# Altium schematic sheet Motor Interface - Top Sheet.SchDoc: Title
size B; Organization: Midnight Sun Solar Rayce Car Team; Address1: University of Waterloo; Address2: 200 University Ave W; Address3: Waterloo, ON, Canada; Address4: N2L 3E9; DocumentNumber: 1; SheetNumber: 1; SheetTotal: 6; Website: www.uwmidsun.com; ProjectName: ProjectName
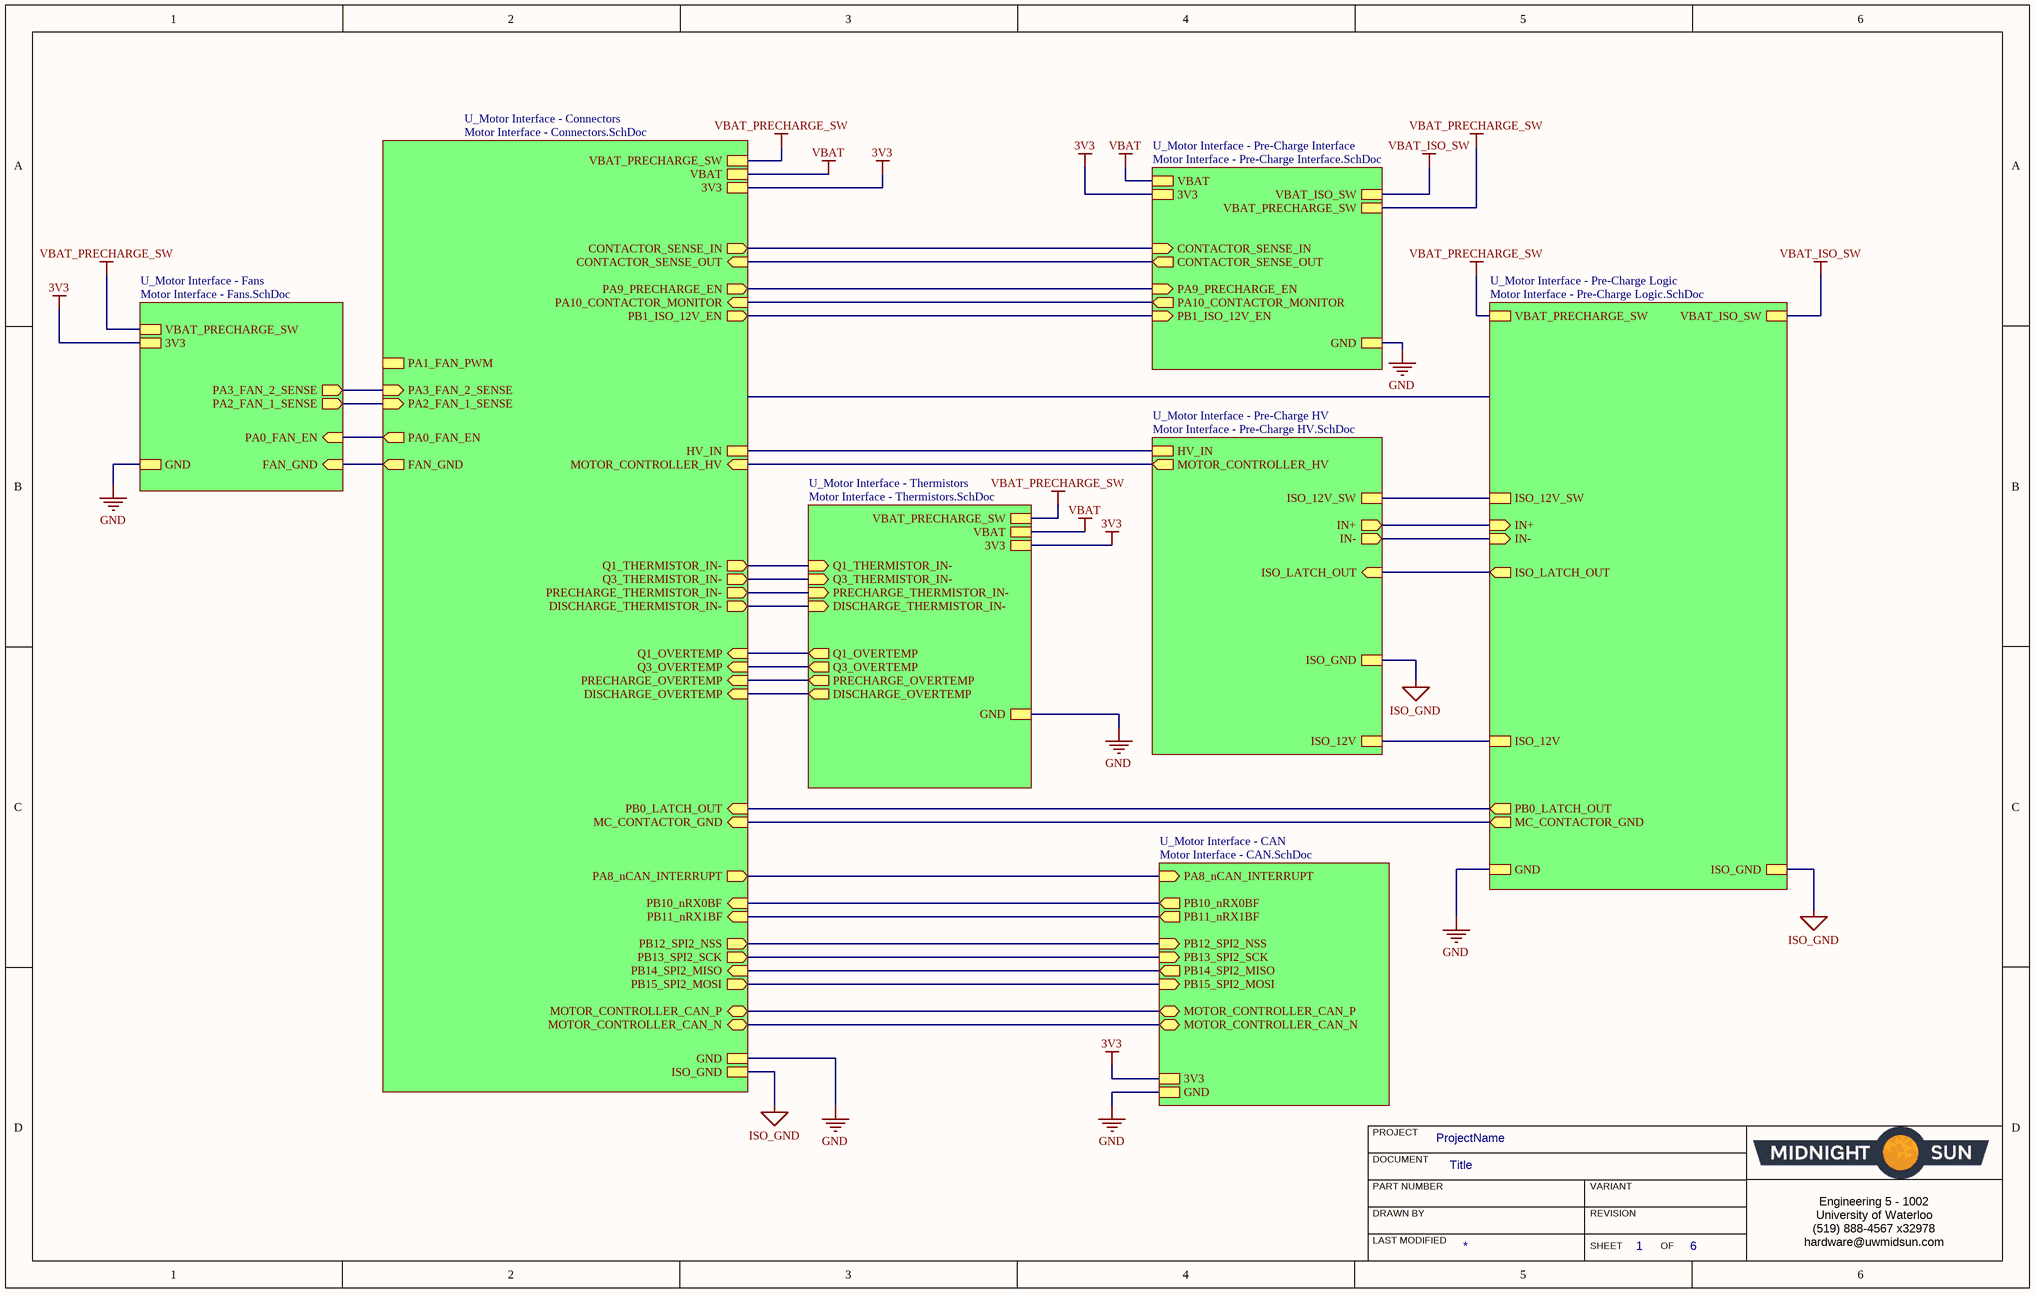
[diagram p0: Motor Interface - Top Sheet.SchDoc]

## Sub-sheets
U_Motor Interface - CAN = Motor Interface - CAN.SchDoc: PB12_SPI2_NSS (in), PB14_SPI2_MISO (out), PB15_SPI2_MOSI (in), PB13_SPI2_SCK (in), PA8_nCAN_INTERRUPT (in), MOTOR_CONTROLLER_CAN_P (bidir), MOTOR_CONTROLLER_CAN_N (bidir), PB10_nRX0BF (out), PB11_nRX1BF (out), 3V3, GND
U_Motor Interface - Connectors = Motor Interface - Connectors.SchDoc: MOTOR_CONTROLLER_HV (in), MOTOR_CONTROLLER_CAN_P (bidir), MOTOR_CONTROLLER_CAN_N (bidir), CONTACTOR_SENSE_IN (out), CONTACTOR_SENSE_OUT (in), PB10_nRX0BF (in), PB11_nRX1BF (in), PA10_CONTACTOR_MONITOR (in), PB12_SPI2_NSS (out), PB15_SPI2_MOSI (out), HV_IN, ISO_GND, PA9_PRECHARGE_EN (out), PB13_SPI2_SCK (out), VBAT, PA8_nCAN_INTERRUPT (out), PB14_SPI2_MISO (in), 3V3, GND, VBAT_PRECHARGE_SW, PB0_LATCH_OUT (in), FAN_GND (out), PA0_FAN_EN (out), PA2_FAN_1_SENSE (in), PA3_FAN_2_SENSE (in), Q1_THERMISTOR_IN- (out), Q3_THERMISTOR_IN- (out), PRECHARGE_THERMISTOR_IN- (out), DISCHARGE_THERMISTOR_IN- (out), Q1_OVERTEMP (in), Q3_OVERTEMP (in), PRECHARGE_OVERTEMP (in), DISCHARGE_OVERTEMP (in), MC_CONTACTOR_GND (in), PB1_ISO_12V_EN (out), PA1_FAN_PWM
U_Motor Interface - Fans = Motor Interface - Fans.SchDoc: GND, FAN_GND (in), PA0_FAN_EN (in), PA2_FAN_1_SENSE (out), PA3_FAN_2_SENSE (out), VBAT_PRECHARGE_SW, 3V3
U_Motor Interface - Pre-Charge HV = Motor Interface - Pre-Charge HV.SchDoc: MOTOR_CONTROLLER_HV (out), IN- (out), IN+ (out), ISO_LATCH_OUT (in), ISO_12V_SW, HV_IN, ISO_GND, ISO_12V
U_Motor Interface - Pre-Charge Interface = Motor Interface - Pre-Charge Interface.SchDoc: CONTACTOR_SENSE_IN (in), CONTACTOR_SENSE_OUT (out), PA9_PRECHARGE_EN (in), GND, PA10_CONTACTOR_MONITOR (out), 3V3, VBAT, VBAT_PRECHARGE_SW, VBAT_ISO_SW, PB1_ISO_12V_EN (in)
U_Motor Interface - Pre-Charge Logic = Motor Interface - Pre-Charge Logic.SchDoc: ISO_LATCH_OUT (out), GND, ISO_GND, ISO_12V_SW, IN- (in), IN+ (in), VBAT_PRECHARGE_SW, PB0_LATCH_OUT (out), ISO_12V, MC_CONTACTOR_GND (out), VBAT_ISO_SW
U_Motor Interface - Thermistors = Motor Interface - Thermistors.SchDoc: Q1_THERMISTOR_IN- (in), Q3_THERMISTOR_IN- (in), PRECHARGE_THERMISTOR_IN- (in), DISCHARGE_THERMISTOR_IN- (in), Q1_OVERTEMP (out), Q3_OVERTEMP (out), PRECHARGE_OVERTEMP (out), DISCHARGE_OVERTEMP (out), GND, 3V3, VBAT, VBAT_PRECHARGE_SW

## Nets
3V3: sheet U_Motor Interface - CAN/3V3, sheet U_Motor Interface - Pre-Charge Interface/3V3, sheet U_Motor Interface - Connectors/3V3, sheet U_Motor Interface - Fans/3V3, sheet U_Motor Interface - Thermistors/3V3
GND: sheet U_Motor Interface - CAN/GND, sheet U_Motor Interface - Pre-Charge Interface/GND, sheet U_Motor Interface - Connectors/GND, sheet U_Motor Interface - Pre-Charge Logic/GND, sheet U_Motor Interface - Fans/GND, sheet U_Motor Interface - Thermistors/GND
ISO_GND: sheet U_Motor Interface - Pre-Charge HV/ISO_GND, sheet U_Motor Interface - Connectors/ISO_GND, sheet U_Motor Interface - Pre-Charge Logic/ISO_GND
VBAT: sheet U_Motor Interface - Pre-Charge Interface/VBAT, sheet U_Motor Interface - Connectors/VBAT, sheet U_Motor Interface - Thermistors/VBAT
VBAT_ISO_SW: sheet U_Motor Interface - Pre-Charge Interface/VBAT_ISO_SW, sheet U_Motor Interface - Pre-Charge Logic/VBAT_ISO_SW
VBAT_PRECHARGE_SW: sheet U_Motor Interface - Pre-Charge Interface/VBAT_PRECHARGE_SW, sheet U_Motor Interface - Connectors/VBAT_PRECHARGE_SW, sheet U_Motor Interface - Pre-Charge Logic/VBAT_PRECHARGE_SW, sheet U_Motor Interface - Fans/VBAT_PRECHARGE_SW, sheet U_Motor Interface - Thermistors/VBAT_PRECHARGE_SW
(unnamed): sheet U_Motor Interface - CAN/PB12_SPI2_NSS, sheet U_Motor Interface - Connectors/PB12_SPI2_NSS
(unnamed): sheet U_Motor Interface - CAN/PB14_SPI2_MISO, sheet U_Motor Interface - Connectors/PB14_SPI2_MISO
(unnamed): sheet U_Motor Interface - CAN/PB15_SPI2_MOSI, sheet U_Motor Interface - Connectors/PB15_SPI2_MOSI
(unnamed): sheet U_Motor Interface - CAN/PB13_SPI2_SCK, sheet U_Motor Interface - Connectors/PB13_SPI2_SCK
(unnamed): sheet U_Motor Interface - CAN/PA8_nCAN_INTERRUPT, sheet U_Motor Interface - Connectors/PA8_nCAN_INTERRUPT
(unnamed): sheet U_Motor Interface - CAN/MOTOR_CONTROLLER_CAN_P, sheet U_Motor Interface - Connectors/MOTOR_CONTROLLER_CAN_P
(unnamed): sheet U_Motor Interface - CAN/MOTOR_CONTROLLER_CAN_N, sheet U_Motor Interface - Connectors/MOTOR_CONTROLLER_CAN_N
(unnamed): sheet U_Motor Interface - CAN/PB10_nRX0BF, sheet U_Motor Interface - Connectors/PB10_nRX0BF
(unnamed): sheet U_Motor Interface - CAN/PB11_nRX1BF, sheet U_Motor Interface - Connectors/PB11_nRX1BF
(unnamed): sheet U_Motor Interface - Pre-Charge HV/MOTOR_CONTROLLER_HV, sheet U_Motor Interface - Connectors/MOTOR_CONTROLLER_HV
(unnamed): sheet U_Motor Interface - Pre-Charge HV/IN-, sheet U_Motor Interface - Pre-Charge Logic/IN-
(unnamed): sheet U_Motor Interface - Pre-Charge HV/IN+, sheet U_Motor Interface - Pre-Charge Logic/IN+
(unnamed): sheet U_Motor Interface - Pre-Charge HV/ISO_LATCH_OUT, sheet U_Motor Interface - Pre-Charge Logic/ISO_LATCH_OUT
(unnamed): sheet U_Motor Interface - Pre-Charge HV/ISO_12V_SW, sheet U_Motor Interface - Pre-Charge Logic/ISO_12V_SW
(unnamed): sheet U_Motor Interface - Pre-Charge HV/HV_IN, sheet U_Motor Interface - Connectors/HV_IN
(unnamed): sheet U_Motor Interface - Pre-Charge HV/ISO_12V, sheet U_Motor Interface - Pre-Charge Logic/ISO_12V
(unnamed): sheet U_Motor Interface - Pre-Charge Interface/CONTACTOR_SENSE_IN, sheet U_Motor Interface - Connectors/CONTACTOR_SENSE_IN
(unnamed): sheet U_Motor Interface - Pre-Charge Interface/CONTACTOR_SENSE_OUT, sheet U_Motor Interface - Connectors/CONTACTOR_SENSE_OUT
(unnamed): sheet U_Motor Interface - Pre-Charge Interface/PA9_PRECHARGE_EN, sheet U_Motor Interface - Connectors/PA9_PRECHARGE_EN
(unnamed): sheet U_Motor Interface - Pre-Charge Interface/PA10_CONTACTOR_MONITOR, sheet U_Motor Interface - Connectors/PA10_CONTACTOR_MONITOR
(unnamed): sheet U_Motor Interface - Pre-Charge Interface/PB1_ISO_12V_EN, sheet U_Motor Interface - Connectors/PB1_ISO_12V_EN
(unnamed): sheet U_Motor Interface - Connectors/PB0_LATCH_OUT, sheet U_Motor Interface - Pre-Charge Logic/PB0_LATCH_OUT
(unnamed): sheet U_Motor Interface - Connectors/FAN_GND, sheet U_Motor Interface - Fans/FAN_GND
(unnamed): sheet U_Motor Interface - Connectors/PA0_FAN_EN, sheet U_Motor Interface - Fans/PA0_FAN_EN
(unnamed): sheet U_Motor Interface - Connectors/PA2_FAN_1_SENSE, sheet U_Motor Interface - Fans/PA2_FAN_1_SENSE
(unnamed): sheet U_Motor Interface - Connectors/PA3_FAN_2_SENSE, sheet U_Motor Interface - Fans/PA3_FAN_2_SENSE
(unnamed): sheet U_Motor Interface - Connectors/Q1_THERMISTOR_IN-, sheet U_Motor Interface - Thermistors/Q1_THERMISTOR_IN-
(unnamed): sheet U_Motor Interface - Connectors/Q3_THERMISTOR_IN-, sheet U_Motor Interface - Thermistors/Q3_THERMISTOR_IN-
(unnamed): sheet U_Motor Interface - Connectors/PRECHARGE_THERMISTOR_IN-, sheet U_Motor Interface - Thermistors/PRECHARGE_THERMISTOR_IN-
(unnamed): sheet U_Motor Interface - Connectors/DISCHARGE_THERMISTOR_IN-, sheet U_Motor Interface - Thermistors/DISCHARGE_THERMISTOR_IN-
(unnamed): sheet U_Motor Interface - Connectors/Q1_OVERTEMP, sheet U_Motor Interface - Thermistors/Q1_OVERTEMP
(unnamed): sheet U_Motor Interface - Connectors/Q3_OVERTEMP, sheet U_Motor Interface - Thermistors/Q3_OVERTEMP
(unnamed): sheet U_Motor Interface - Connectors/PRECHARGE_OVERTEMP, sheet U_Motor Interface - Thermistors/PRECHARGE_OVERTEMP
(unnamed): sheet U_Motor Interface - Connectors/DISCHARGE_OVERTEMP, sheet U_Motor Interface - Thermistors/DISCHARGE_OVERTEMP
(unnamed): sheet U_Motor Interface - Connectors/MC_CONTACTOR_GND, sheet U_Motor Interface - Pre-Charge Logic/MC_CONTACTOR_GND

## Notes on the sheet
- PROJECT
- DOCUMENT
- DRAWN BY
- LAST MODIFIED
- PART NUMBER
- REVISION
- SHEET
- VARIANT
- OF
- Engineering 5 - 1002
  University of Waterloo
  (519) 888-4567 x32978
  hardware@uwmidsun.com